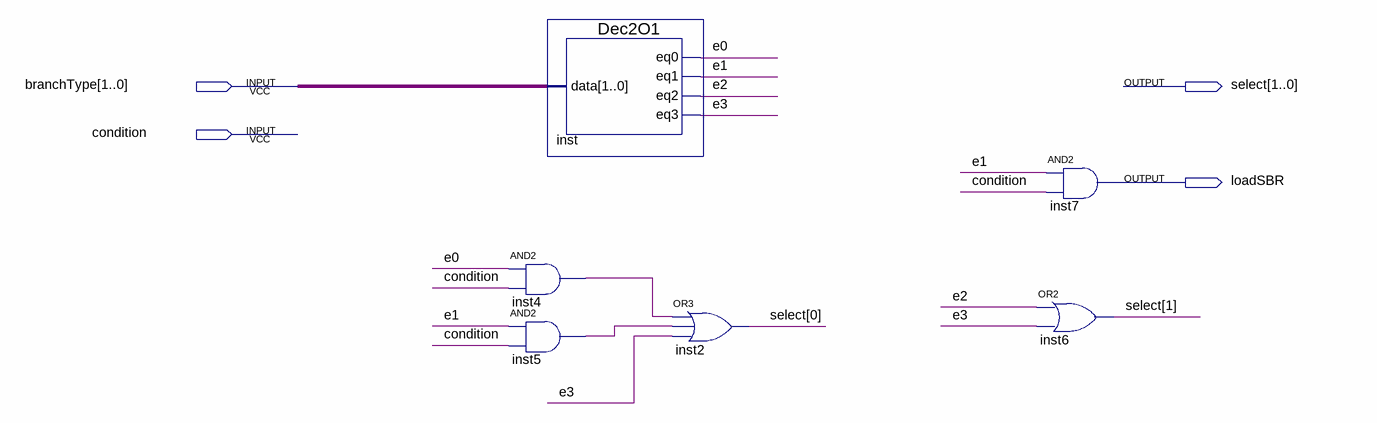
[diagram p0: schematic sheet]
// Quartus schematic branchSelect.bdf as structural Verilog: 6 symbols, 4 pins
module branchSelect (
  input  [1:0] branchType,
  input  condition,
  output [1:0] select,
  output loadSBR
);

  wire e0, e1, e2, e3, inst4_out, inst5_out;

  Dec2O1 inst (.data(branchType), .eq0(e0), .eq1(e1), .eq2(e2), .eq3(e3));
  and inst4 (inst4_out, e0, condition);
  and inst5 (inst5_out, e1, condition);
  or inst2 (select[0], inst4_out, inst5_out, e3);
  and inst7 (loadSBR, e1, condition);
  or inst6 (select[1], e2, e3);
endmodule
